# EAGLE design tick-mini-mk-2.0 (EAGLE 6.5.0)
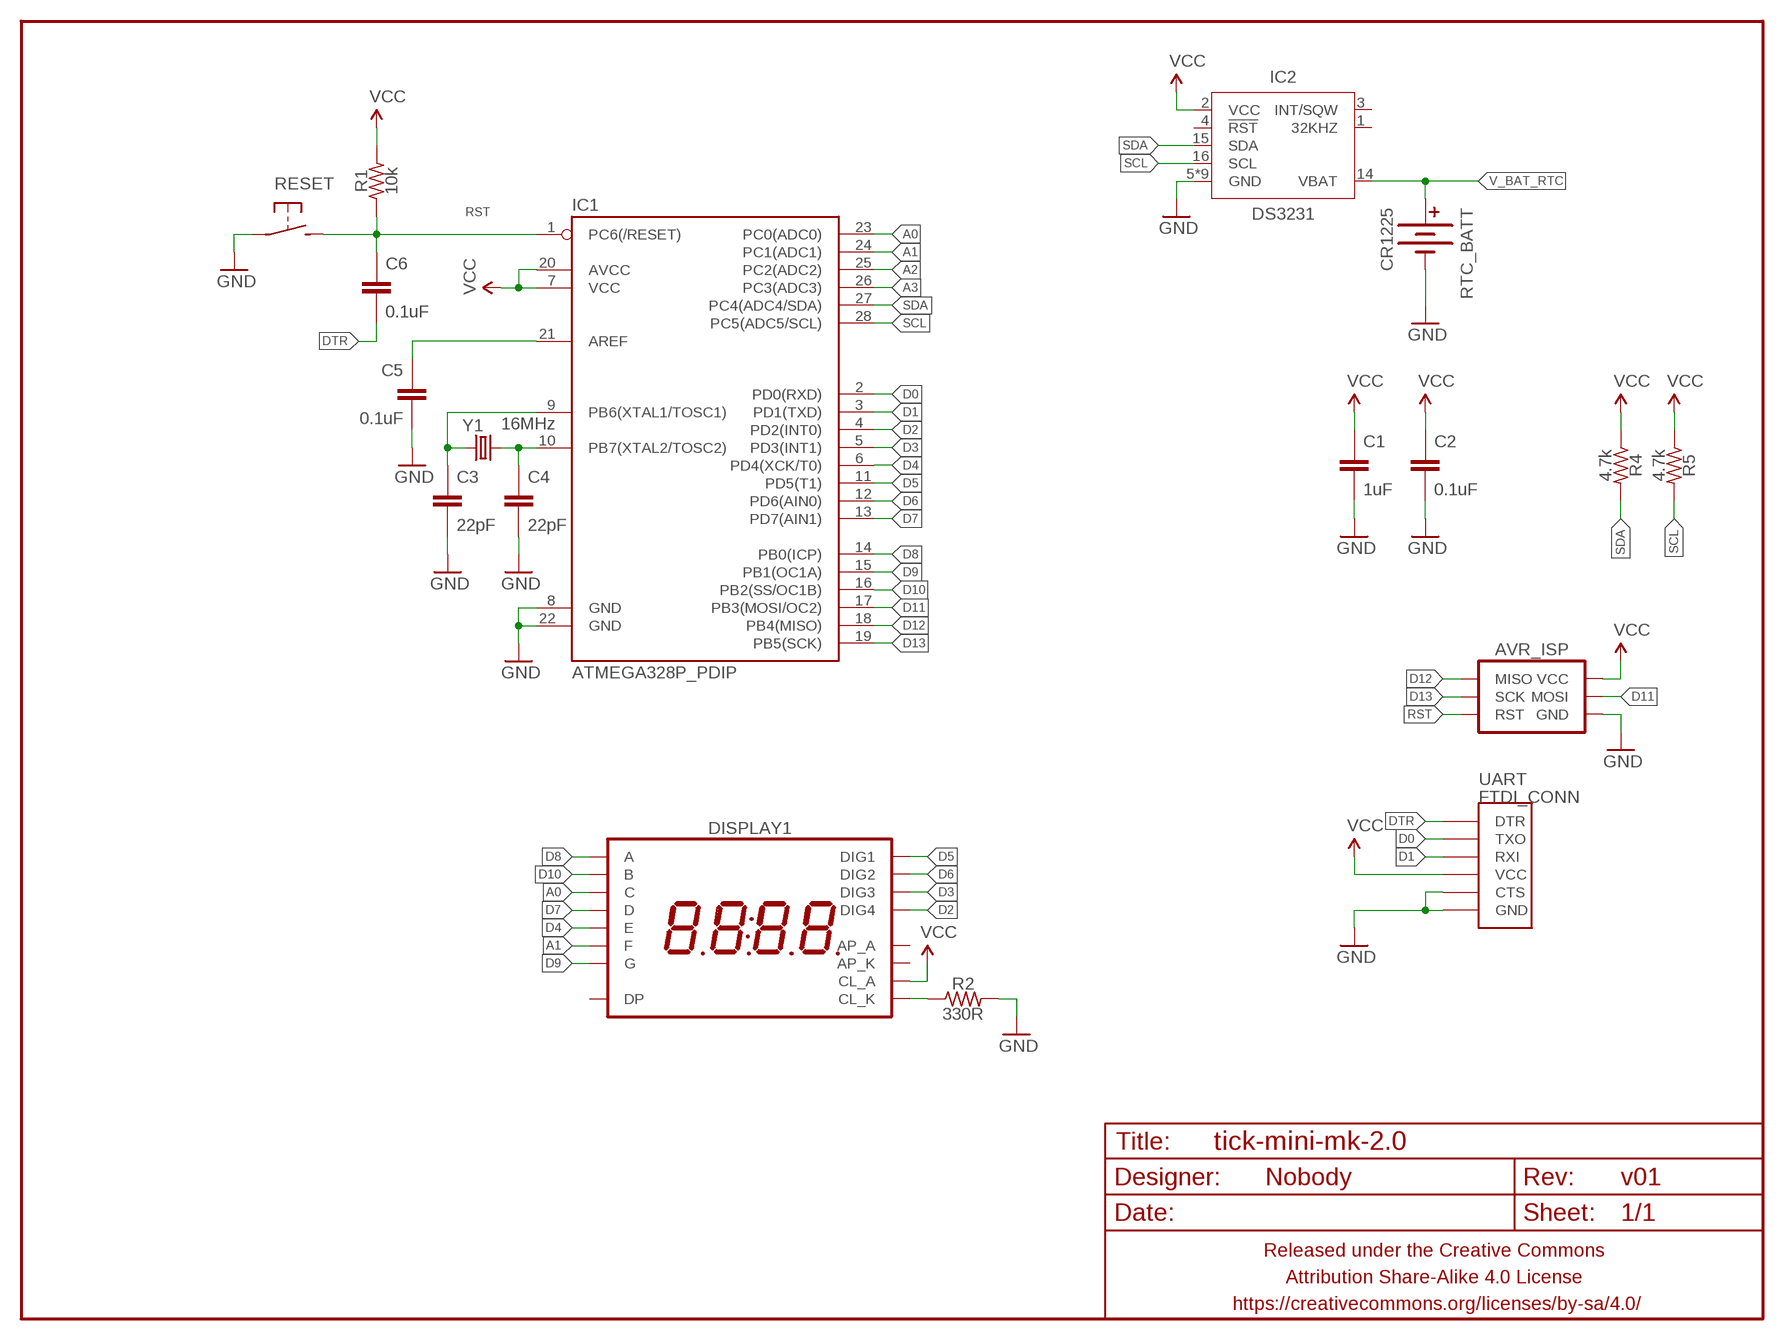
[diagram p0: schematic, sheet 1]

## Parts
AVR_ISP  AVR_SPI_PRG_6PTH  [2X3]
C1  1uF  CAPACITOR-CERAMIC025-024X044  [C025-024X044]
C2  0.1uF  CAPACITOR-CERAMIC025-024X044  [C025-024X044]
C3  22pF  CAPACITOR-CERAMIC025-024X044  [C025-024X044]
C4  22pF  CAPACITOR-CERAMIC025-024X044  [C025-024X044]
C5  0.1uF  CAPACITOR-CERAMIC025-024X044  [C025-024X044]
C6  0.1uF  CAPACITOR-CERAMIC025-024X044  [C025-024X044]
DISPLAY1  7SEG_4DIGIT_COLON_APOS  [7SEG_4DIG_10MM]
FRAME1  FRAME-LETTERNO_PACKAGE  [DUMMY]
IC1  ATMEGA328P_PDIP  [DIL28-3]
IC2  DS3231  [SO16W]
R1  10k  RESISTORPTH-AXIAL-6.35MM  [RESISTOR-AXIAL-PTH-6.35MM]
R2  330R  RESISTORPTH-AXIAL-6.35MM  [RESISTOR-AXIAL-PTH-6.35MM]
R4  4.7k  RESISTORPTH-AXIAL-6.35MM  [RESISTOR-AXIAL-PTH-6.35MM]
R5  4.7k  RESISTORPTH-AXIAL-6.35MM  [RESISTOR-AXIAL-PTH-6.35MM]
RESET  SPST-NO-TACT6MM-PTH-SMALL-PADS  [DTS-6-SMALL-PADS]
RTC_BATT  CR1225  BATTERY12PTH_TOPLOAD  [BATTCON_12MM_PTH_TOPLOAD]
UART  FTDI_CONN  [FTDI_CONN]
Y1  16MHz  CRYSTALHC49UV  [HC49U-V]

## Nets
A0: DISPLAY1.13(C) IC1.23(PC0(ADC0))
A1: DISPLAY1.11(F) IC1.24(PC1(ADC1))
A2: IC1.25(PC2(ADC2))
A3: IC1.26(PC3(ADC3))
D0: IC1.2(PD0(RXD)) UART.TXO
D1: IC1.3(PD1(TXD)) UART.RXI
D2: DISPLAY1.8(DIG4) IC1.4(PD2(INT0))
D3: DISPLAY1.6(DIG3) IC1.5(PD3(INT1))
D4: DISPLAY1.5(E) IC1.6(PD4(XCK/T0))
D5: DISPLAY1.1(DIG1) IC1.11(PD5(T1))
D6: DISPLAY1.2(DIG2) IC1.12(PD6(AIN0))
D7: DISPLAY1.3(D) IC1.13(PD7(AIN1))
D8: DISPLAY1.14(A) IC1.14(PB0(ICP))
D9: DISPLAY1.15(G) IC1.15(PB1(OC1A))
D10: DISPLAY1.16(B) IC1.16(PB2(SS/OC1B))
D11: AVR_ISP.4(MOSI) IC1.17(PB3(MOSI/OC2))
D12: AVR_ISP.1(MISO) IC1.18(PB4(MISO))
D13: AVR_ISP.3(SCK) IC1.19(PB5(SCK))
DTR: C6.2 UART.DTR
GND: AVR_ISP.6(GND) C1.2 C2.2 C3.2 C4.2 C5.2 IC1.8(GND) IC1.22(GND) IC2.5(GND) IC2.6(GND) IC2.7(GND) IC2.8(GND) IC2.9(GND) IC2.10(GND) IC2.11(GND) IC2.12(GND) IC2.13(GND) R2.P$2 RESET.1 RESET.2 RTC_BATT.- UART.CTS UART.GND
N$1: C4.1 IC1.10(PB7(XTAL2/TOSC2)) Y1.2
N$2: C3.1 IC1.9(PB6(XTAL1/TOSC1)) Y1.1
N$3: C5.1 IC1.21(AREF)
N$4: DISPLAY1.12(CL_K) R2.P$1
RST: AVR_ISP.5(RST) C6.1 IC1.1(PC6(/RESET)) R1.P$1 RESET.3 RESET.4
SCL: IC1.28(PC5(ADC5/SCL)) IC2.16(SCL) R5.P$2
SDA: IC1.27(PC4(ADC4/SDA)) IC2.15(SDA) R4.P$2
V_BAT_RTC: IC2.14(VBAT) RTC_BATT.+
VCC: AVR_ISP.2(VCC) C1.1 C2.1 DISPLAY1.4(CL_A) IC1.7(VCC) IC1.20(AVCC) IC2.2(VCC) R1.P$2 R4.P$1 R5.P$1 UART.VCC
Unconnected: DISPLAY1.7(DP) DISPLAY1.9(AP_K) DISPLAY1.10(AP_A) IC2.1(32KHZ) IC2.3(INT/SQW) IC2.4(!RST)

## Library data of the parts
AVR_ISP = A_butts:AVR_SPI_PRG_6: AVR ISP 6 Pin This is the reduced ISP connector for AVR programming. Common on Arduino. This footprint will take up less PCB space and can be used with a 10-pin to 6-pin adapter such as SKU: BOB-08508 **Special note about "TEST_POINT" package. The stop mask is on the top side, so if you want your programming test points to be on the bottom of your board, make sure to place this package on the bottom side of the board. This also ensure that the orientation to program from the bottom side will be correct.
C1-C6 = A_butts:CAPACITOR-CERAMIC: CAPACITOR, European symbol
DISPLAY1 = A_butts:7SEG_4DIGIT_COLON_APOS
FRAME1 = A_butts:FRAME-LETTER: Schematic Frame Standard 8.5x11 US Letter frame; DESIGNER: Nobody; VERSION: v01
IC1 = A_butts:ATMEGA328P_PDIP: uC used in the Arduino 32kb flash, 1k EEPROM, 2k SRAM This is the through-hole version of this chip.
IC2 = A_butts:DS3231
R1 R2 R4 R5 = A_butts:RESISTOR: RESISTOR, American symbol
RESET = A_butts:SPST-NO-TACT
RTC_BATT = A_butts:BATTERY: Battery Holders Various common sizes : AA, AAA, 20mm coin cell and 12mm coin cell. 20MM_4LEGS, BATT-10373
UART = A_butts:FTDI_CONN: Connector which mates to FTDI basic or FTDI cable.
Y1 = A_butts:CRYSTAL: Various standard crystals. Proven footprints. Spark Fun Electronics SKU : COM-00534

## Board
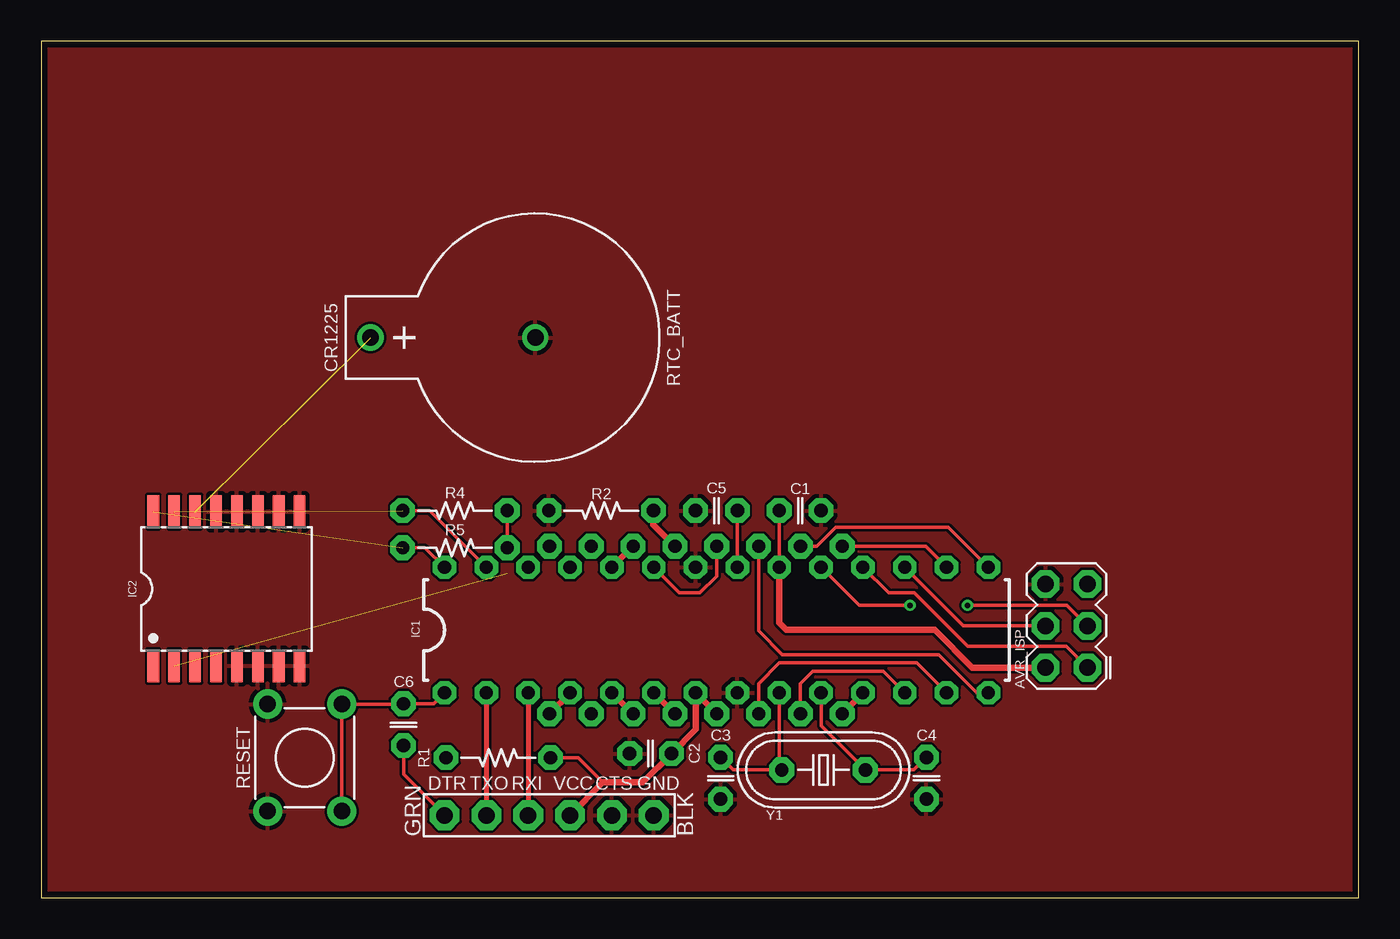
[diagram p1: board, top side]
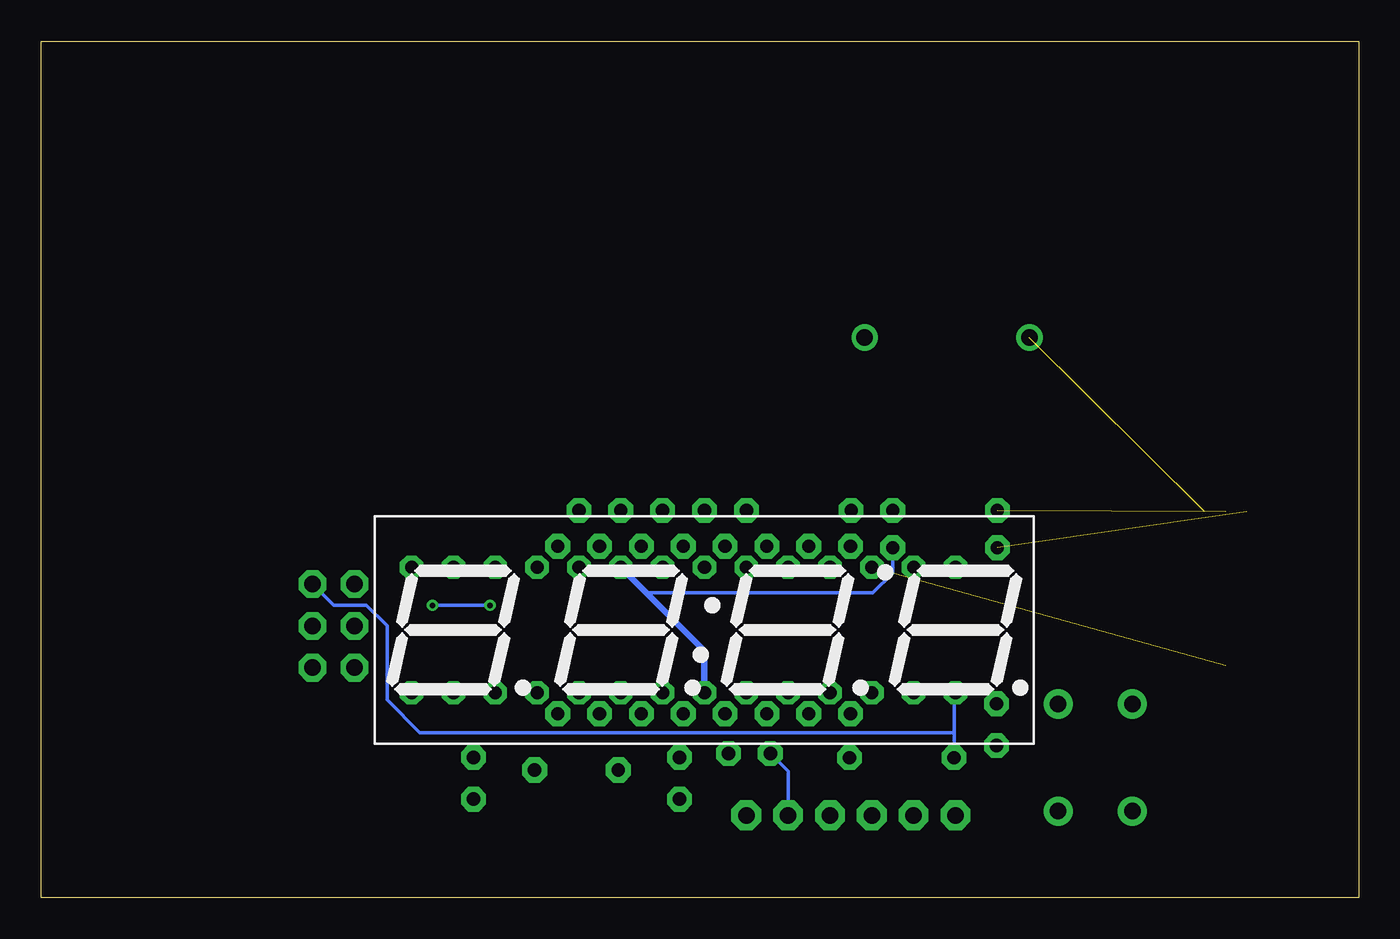
[diagram p2: board, bottom side, seen from below]

Size 80 x 52 mm. Coordinates in mm from the lower left corner, seen from the top.
Outline: 80,0 80,52 0,52 0,0 80,0
Copper layers (1*16): Top 0.0356mm / dielectric 1.5011mm / Bottom 0.0356mm
Design rules "LaenPCBOrder_2": minimum track width 6mil, minimum drill 13mil, track to track 6mil, track to pad 6mil, pad to pad 6mil, via to via 6mil, smd to smd 6mil, copper to edge 15mil, drill to drill 6mil, minimum pad ring 7mil, minimum via ring 7mil, stop-mask expansion 3mil, vias tented up to drill 20mil, thermal gap 10mil

### Footprints (pad centres in the part's own frame; a part is rotated, then mirrored left to right if it is on the bottom)
2X3 = drill 1 pad 1.676 octagon: 1 -2.54,-1.27; 2 -2.54,1.27; 3 0,-1.27; 4 0,1.27; 5 2.54,-1.27; 6 2.54,1.27
C025-024X044 = drill 0.813 pad 1.5 octagon: 1 -1.27,0; 2 1.27,0
7SEG_4DIG_10MM = drill 0.8 pad 1.5 octagon: 1 -8.89,-5.08; 2 -6.35,-5.08; 3 -3.81,-5.08; 4 -1.27,-5.08; 5 1.27,-5.08; 6 3.81,-5.08; 7 6.35,-5.08; 8 8.89,-5.08; 9 8.89,5.08; 10 6.35,5.08; 11 3.81,5.08; 12 1.27,5.08; 13 -1.27,5.08; 14 -3.81,5.08; 15 -6.35,5.08; 16 -8.89,5.08
DIL28-3 = drill 0.8 pad 1.422 octagon: 1 -16.51,-3.81; 2 -13.97,-3.81; 3 -11.43,-3.81; 4 -8.89,-3.81; 5 -6.35,-3.81; 6 -3.81,-3.81; 7 -1.27,-3.81; 8 1.27,-3.81; 9 3.81,-3.81; 10 6.35,-3.81; 11 8.89,-3.81; 12 11.43,-3.81; 13 13.97,-3.81; 14 16.51,-3.81; 15 16.51,3.81; 16 13.97,3.81; 17 11.43,3.81; 18 8.89,3.81; 19 6.35,3.81; 20 3.81,3.81; 21 1.27,3.81; 22 -1.27,3.81; 23 -3.81,3.81; 24 -6.35,3.81; 25 -8.89,3.81; 26 -11.43,3.81; 27 -13.97,3.81; 28 -16.51,3.81
SO16W = smd 0.7 x 2: 1 -4.445,-4.685; 2 -3.175,-4.685; 3 -1.905,-4.685; 4 -0.635,-4.685; 5 0.635,-4.685; 6 1.905,-4.685; 7 3.175,-4.685; 8 4.445,-4.685; 9 4.445,4.685; 10 3.175,4.685; 11 1.905,4.685; 12 0.635,4.685; 13 -0.635,4.685; 14 -1.905,4.685; 15 -3.175,4.685; 16 -4.445,4.685
RESISTOR-AXIAL-PTH-6.35MM = drill 0.8 pad 1.5 octagon: P$1 -3.175,0; P$2 3.175,0
DTS-6-SMALL-PADS = drill 1 pad 1.778: 1 -3.25,2.25; 2 3.25,2.25; 3 -3.25,-2.25; 4 3.25,-2.25
BATTCON_12MM_PTH_TOPLOAD = drill 1 pad 1.6: + 10,0; - 0,0
FTDI_CONN = drill 1 pad 1.8 octagon: CTS 3.81,0; DTR -6.35,0; GND 6.35,0; RXI -1.27,0; TXO -3.81,0; VCC 1.27,0
HC49U-V = drill 0.813 pad 1.524 octagon: 1 -2.54,0; 2 2.54,0

### Placement (x,y rotation side)
AVR_ISP  62.25,16.5 90 top
C1  46.08,23.5 0 top
C2  37,8.75 180 top
C3  41.25,7.25 270 top
C4  53.75,7.25 270 top
C5  41,23.5 180 top
C6  22,10.5 270 top
DISPLAY1  39.75,16.25 0 bottom
FRAME1  0,0 0 top
IC1  41,16.25 0 top
IC2  11.25,18.75 0 top
R1  27.75,8.5 0 top
R2  34,23.5 180 top
R4  25.12,23.5 180 top
R5  25.12,21.25 180 top
RESET  16,8.5 90 top
RTC_BATT  30,34 180 top
UART  30.84,5 0 top
Y1  47.5,7.75 0 top

### Tracks (layer width: path | path; a pad name or v marks a point on that pad's centre or on a via)
A0
  Top 0.2: IC1.23 38.75,18.5 40,18.5 41.02,19.52 DISPLAY1.13
A1
  Top 0.4: IC1.24 35.92,21.33 DISPLAY1.11
D0
  Top 0.3: IC1.2 UART.TXO
D1
  Top 0.3: IC1.3 UART.RXI
D2
  Top 0.4: DISPLAY1.8 32.11,12.42 IC1.4
D3
  Top 0.4: IC1.5 35.92,11.17 DISPLAY1.6
D4
  Top 0.4: IC1.6 38.46,11.17 DISPLAY1.5
D5
  Top 0.4: DISPLAY1.1 49.89,12.42 IC1.11
D6
  Top 0.2: DISPLAY1.2 46.1,13 46.85,13.75 51.12,13.75 IC1.12
D7
  Top 0.2: DISPLAY1.3 43.56,13 44.81,14.25 53.16,14.25 IC1.13
D8
  Top 0.2: DISPLAY1.14 43.56,16.19 45,14.75 54.5,14.75 56.81,12.44 IC1.14
D9
  Top 0.2: DISPLAY1.15 47.08,21.33 48.25,22.5 55.07,22.5 IC1.15
D10
  Top 0.2: DISPLAY1.16 53.7,21.33 IC1.16
D11
  Top 0.2: AVR_ISP.4 55.99,16.5 IC1.17
D12
  Top 0.2: AVR_ISP.1 62.23,15.25 56.25,15.25 53,18.5 51.45,18.5 IC1.18
D13  (via drill 0.33)
  Top 0.2: v52.75,17.75 49.66,17.75 IC1.19 | v56.25,17.75 62.27,17.75 AVR_ISP.3
  Bottom 0.2: v52.75,17.75 v56.25,17.75
DTR
  Top 0.2: C6.2 22,7.49 UART.DTR
GND
  Bottom 0.2: UART.CTS 34.65,7.67 C2.2
  pour Top: -0.1,52.1 80.1,52.1 80.1,-0.1 -0.1,-0.1
N$1
  Top 0.2: IC1.10 47.35,10.44 Y1.2 52.98,7.75 C4.1
N$2
  Top 0.2: IC1.9 44.81,7.9 Y1.1 42.02,7.75 C3.1
N$3
  Top 0.2: C5.1 IC1.21
N$4
  Top 0.4: DISPLAY1.12 37.17,22.64 R2.P$1
RST
  Top 0.2: IC1.1 23.82,11.77 C6.1 21.98,11.75 RESET.4 RESET.3
  Bottom 0.2: AVR_ISP.5 63.52,19.02 62.25,17.75 60.25,17.75 59,16.5 59,12 57,10 24.57,10 | 24.57,10 R1.P$1 | 24.57,10 24.57,12.36 IC1.1
SCL  (1 unrouted)
  Top 0.2: R5.P$2 23.3,21.25 IC1.28
SDA  (1 unrouted)
  Top 0.2: R4.P$2 23.59,23.5 IC1.27
V_BAT_RTC  (1 unrouted)
VCC  (1 unrouted)
  Top 0.2: C1.1 IC1.20 | 34.11,7 32.61,8.5 R1.P$2 | R5.P$1 R4.P$1
  Top 0.4: AVR_ISP.2 56.54,13.96 54.25,16.25 45.25,16.25 44.81,16.69 IC1.20 | DISPLAY1.4 39.75,12.44 IC1.7 39.73,10.21 C2.1 36.52,7 34.11,7 UART.VCC
  Bottom 0.2: R5.P$1 28.3,19.7 29.5,18.5 43.25,18.5
  Bottom 0.4: IC1.20 43.25,18.5 39.73,14.98 IC1.7